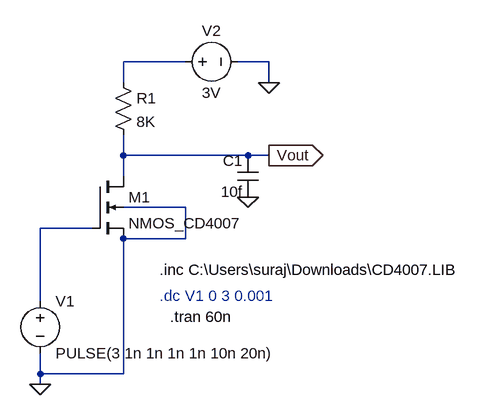
[diagram p0: schematic Resistive_Inverter(CD4007).asc]
Resistive_Inverter(CD4007).asc, the LTspice schematic file:
Version 4
SHEET 1 1176 680
WIRE 288 -48 192 -48
WIRE 416 -48 368 -48
WIRE 192 -16 192 -48
WIRE 416 -16 416 -48
WIRE 192 96 192 64
WIRE 384 96 192 96
WIRE 416 96 384 96
WIRE 192 128 192 96
WIRE 288 176 192 176
WIRE 144 208 64 208
WIRE 192 224 192 208
WIRE 288 224 288 176
WIRE 288 224 192 224
WIRE 64 320 64 208
WIRE 64 432 64 400
WIRE 192 432 192 224
WIRE 192 432 64 432
WIRE 64 448 64 432
FLAG 64 448 0
FLAG 416 -16 0
FLAG 384 160 0
FLAG 416 96 Vout
IOPIN 416 96 Out
SYMBOL nmos4 144 128 R0
SYMATTR InstName M1
SYMATTR Value NMOS_CD4007
SYMATTR Value2 l=5u w=170u
SYMBOL res 176 -32 R0
SYMATTR InstName R1
SYMATTR Value 8K
SYMBOL voltage 64 304 R0
WINDOW 123 0 0 Left 0
WINDOW 39 0 0 Left 0
SYMATTR InstName V1
SYMATTR Value PULSE(3 1n 1n 1n 1n 10n 20n)
SYMBOL voltage 272 -48 R270
WINDOW 0 32 56 VTop 2
WINDOW 3 -32 56 VBottom 2
WINDOW 123 0 0 Left 0
WINDOW 39 0 0 Left 0
SYMATTR InstName V2
SYMATTR Value 3V
SYMBOL cap 400 96 M0
SYMATTR InstName C1
SYMATTR Value 10f
TEXT 248 272 Left 2 !.inc C:\\Users\\suraj\\Downloads\\CD4007.LIB
TEXT 248 312 Left 2 ;.dc V1 0 3 0.001
TEXT 264 344 Left 2 !.tran 60n

The netlist it stands for:
* Resistive_Inverter(CD4007).asc
M1 Vout N002 0 0 NMOS_CD4007 l=5u w=170u
R1 N001 Vout 8K
V1 N002 0 PULSE(3 1n 1n 1n 1n 10n 20n)
V2 N001 0 3V
C1 Vout 0 10f
.model NMOS NMOS
.model PMOS PMOS
.lib standard.mos
.inc C:\Users\suraj\Downloads\CD4007.LIB
* .dc V1 0 3 0.001
.tran 60n
.backanno
.end